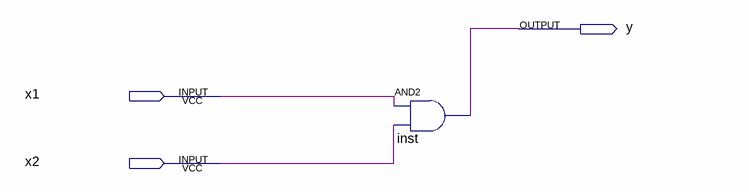
[diagram p0: schematic sheet]
// Quartus schematic test1.bdf as structural Verilog: 1 symbols, 3 pins
module test1 (
  input  x1,
  input  x2,
  output y
);

  and inst (y, x1, x2);
endmodule
